# Altium schematic sheet VRS.SchDoc
size A4; Organization: Altium Limited; Address1: L3, 12a Rodborough Rd; Address2: Frenchs Forest; Address3: NSW; Address4: Australia 2086
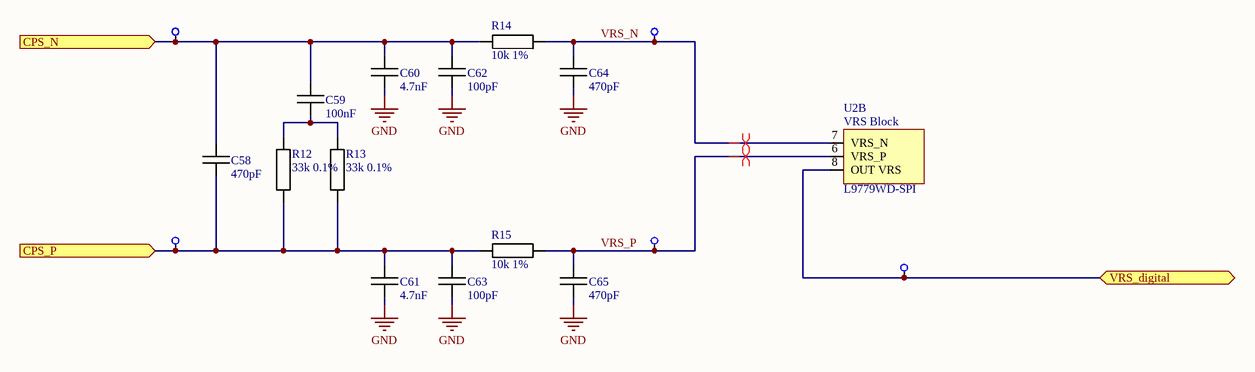
[diagram p0: VRS.SchDoc]

## Parts
C58  470pF  [SMD 0603]
C59  100nF  [SMD 0603]
C60  4.7nF  [SMD 0603]
C61  4.7nF  [SMD 0603]
C62  100pF  [SMD 0603]
C63  100pF  [SMD 0603]
C64  470pF  [SMD 0603]
C65  470pF  [SMD 0603]
R12  33k 0.1%  [SMD 0603]
R13  33k 0.1%  [SMD 0603]
R14  10k 1%  [SMD 0603]
R15  10k 1%  [SMD 0603]
TP38  TestPoint  [TESTPOINT]  (value not drawn)
TP39  TestPoint  [TESTPOINT]  (value not drawn)
TP40  TestPoint  [TESTPOINT]  (value not drawn)
TP41  TestPoint  [TESTPOINT]  (value not drawn)
TP42  TestPoint  [TESTPOINT]  (value not drawn)
U2  L9779WD-SPI  [HiQUAD-64]  (part B of 6)

## Ports
CPS_N (in), CPS_P (in), VRS_digital (bidir)

## Nets
GND: C60.1 C61.1 C62.1 C63.1 C64.1 C65.1
CPS_N: C58.2 C59.1 C60.2 C62.2 R14.1 TP38.0 ; port CPS_N
CPS_P: C58.1 C61.2 C63.2 R12.2 R13.2 R15.1 TP39.0 ; port CPS_P
VRS_digital: TP42.0 U2.8(OUT_VRS) ; port VRS_digital
VRS_N: C64.2 R14.2 TP40.0 U2.7(VRS_N)
VRS_P: C65.2 R15.2 TP41.0 U2.6(VRS_P)
NetC59_2: C59.2 R12.1 R13.1

## Layout directives
differential pair: VRS_N, VRS_P

## Notes on the sheet
- Title
- Size:
- Date:
- A4
- Number:
- Time:
- Revision:
- Sheet
- of
- File:
- (in symbol L9779WD-SPI, part B) VRS Block

## Library data of the parts
C58 C64 C65 = Capasitor: CC0603KRX7R9BB471; Value: 470pF
C59 = Capasitor: CC0603KRX7R9BB104; Value: 100nF
C60 C61 = Capasitor: CC0603KRX7R9BB472; Value: 4.7nF
C62 C63 = Capasitor: CC0603KRX7R9BB101; Value: 100pF
R12 R13 = Resistor: RT0603BRD0733KL; Value: 33k 0.1%
R14 R15 = Resistor: RT0603FRE0710KL; Value: 10k 1%
U2 = L9779WD-SPI: Multifunction IC for engine management system